# Altium schematic sheet Driver.SchDoc
size A3; SheetNumber: 3; SheetTotal: 3
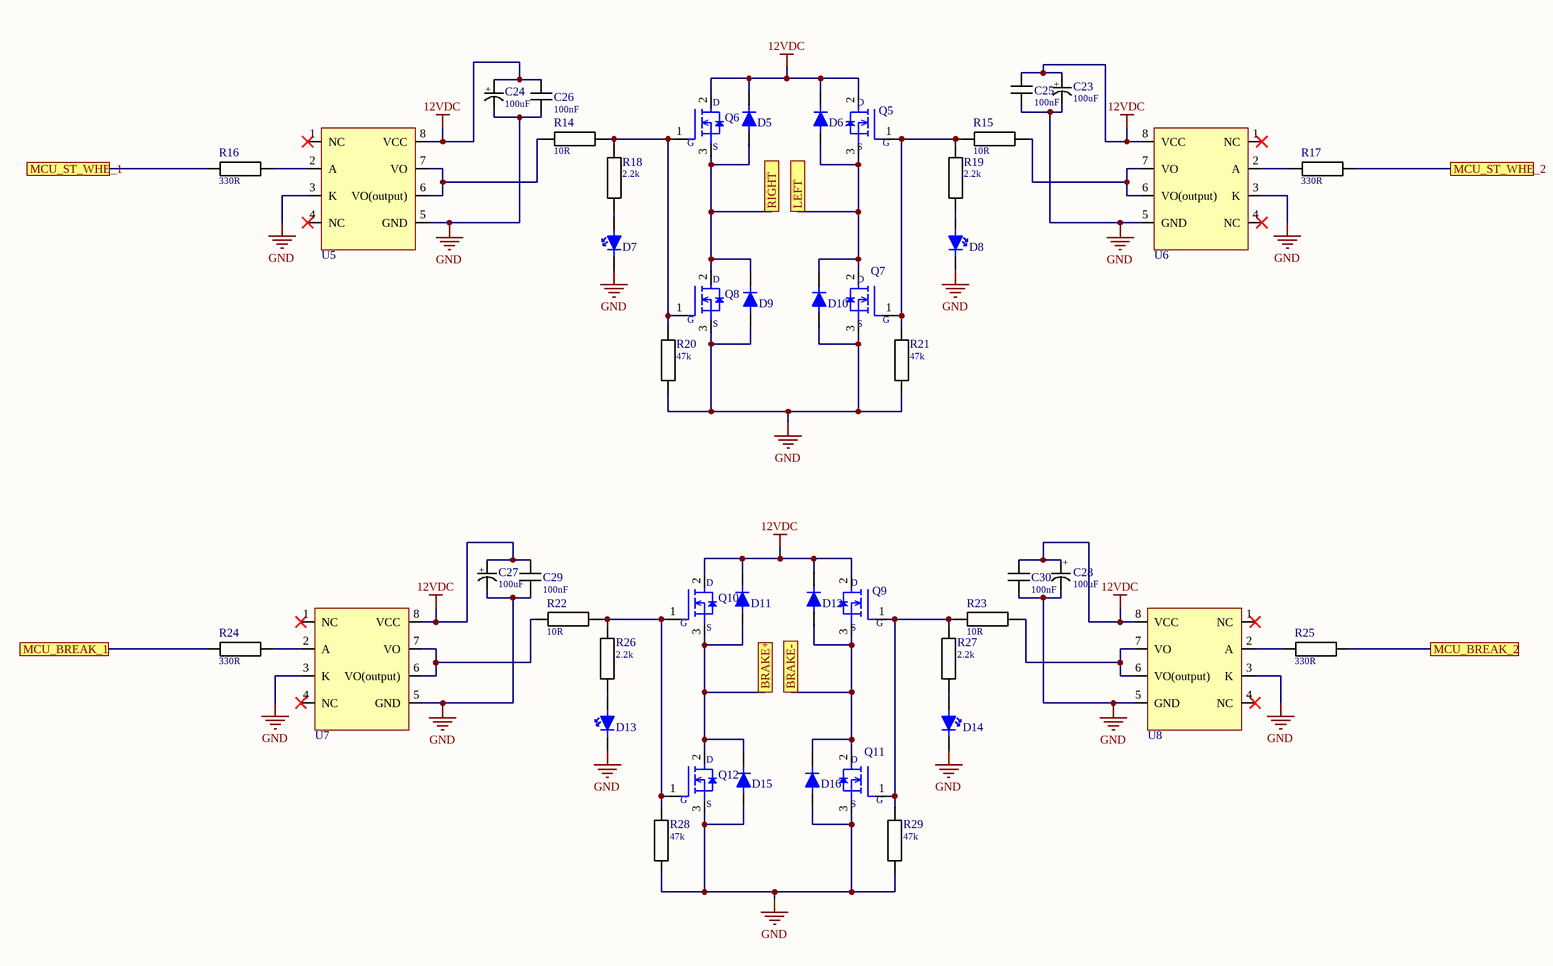
[diagram p0: Driver.SchDoc]

## Parts
C23  Capacitance: 100uF  [CAP_ELEC_EEE-HA0J101WR]  (hidden comment: EEE-HA0J101WR)
C24  Capacitance: 100uF  [CAP_ELEC_EEE-HA0J101WR]  (hidden comment: EEE-HA0J101WR)
C25  Capacitance: 100nF  [CAP_0805]  (hidden comment: C0805C104K5RAC7800)
C26  Capacitance: 100nF  [CAP_0805]  (hidden comment: C0805C104K5RAC7800)
C27  Capacitance: 100uF  [CAP_ELEC_EEE-HA0J101WR]  (hidden comment: EEE-HA0J101WR)
C28  Capacitance: 100uF  [CAP_ELEC_EEE-HA0J101WR]  (hidden comment: EEE-HA0J101WR)
C29  Capacitance: 100nF  [CAP_0805]  (hidden comment: C0805C104K5RAC7800)
C30  Capacitance: 100nF  [CAP_0805]  (hidden comment: C0805C104K5RAC7800)
D5  1N4001W  [SOD-123F]  (value not drawn)
D6  1N4001W  [SOD-123F]  (value not drawn)
D7  LTST-C171GKT  [LED_GREEN_0805]  (value not drawn)
D8  LTST-C171GKT  [LED_GREEN_0805]  (value not drawn)
D9  1N4001W  [SOD-123F]  (value not drawn)
D10  1N4001W  [SOD-123F]  (value not drawn)
D11  1N4001W  [SOD-123F]  (value not drawn)
D12  1N4001W  [SOD-123F]  (value not drawn)
D13  LTST-C171GKT  [LED_GREEN_0805]  (value not drawn)
D14  LTST-C171GKT  [LED_GREEN_0805]  (value not drawn)
D15  1N4001W  [SOD-123F]  (value not drawn)
D16  1N4001W  [SOD-123F]  (value not drawn)
Q5  IRF4905STRRPBF  [TO-263-3]  (value not drawn)
Q6  IRF4905STRRPBF  [TO-263-3]  (value not drawn)
Q7  IRF3710STRLPBF  [TO-263-3]  (value not drawn)
Q8  IRF3710STRLPBF  [TO-263-3]  (value not drawn)
Q9  IRF4905STRRPBF  [TO-263-3]  (value not drawn)
Q10  IRF4905STRRPBF  [TO-263-3]  (value not drawn)
Q11  IRF3710STRLPBF  [TO-263-3]  (value not drawn)
Q12  IRF3710STRLPBF  [TO-263-3]  (value not drawn)
R14  Resistance: 10R  [CAP_0805]  (hidden comment: RC0805FR-0710RL)
R15  Resistance: 10R  [CAP_0805]  (hidden comment: RC0805FR-0710RL)
R16  Resistance: 330R  [RES_0603]  (hidden comment: RC0603FR-07330RL)
R17  Resistance: 330R  [RES_0603]  (hidden comment: RC0603FR-07330RL)
R18  Resistance: 2.2k  [RES_0603]  (hidden comment: RC0603JR-072K2L)
R19  Resistance: 2.2k  [RES_0603]  (hidden comment: RC0603JR-072K2L)
R20  Resistance: 47k  [RES_0603]  (hidden comment: RC0603JR-0747KL)
R21  Resistance: 47k  [RES_0603]  (hidden comment: RC0603JR-0747KL)
R22  Resistance: 10R  [CAP_0805]  (hidden comment: RC0805FR-0710RL)
R23  Resistance: 10R  [CAP_0805]  (hidden comment: RC0805FR-0710RL)
R24  Resistance: 330R  [RES_0603]  (hidden comment: RC0603FR-07330RL)
R25  Resistance: 330R  [RES_0603]  (hidden comment: RC0603FR-07330RL)
R26  Resistance: 2.2k  [RES_0603]  (hidden comment: RC0603JR-072K2L)
R27  Resistance: 2.2k  [RES_0603]  (hidden comment: RC0603JR-072K2L)
R28  Resistance: 47k  [RES_0603]  (hidden comment: RC0603JR-0747KL)
R29  Resistance: 47k  [RES_0603]  (hidden comment: RC0603JR-0747KL)
U5  TLP250LF1F  [8-SMD]  (value not drawn)
U6  TLP250LF1F  [8-SMD]  (value not drawn)
U7  TLP250LF1F  [8-SMD]  (value not drawn)
U8  TLP250LF1F  [8-SMD]  (value not drawn)

## Ports
BRAKE+, BRAKE-, LEFT, MCU_BREAK_1, MCU_BREAK_2, MCU_ST_WHE_1, MCU_ST_WHE_2, RIGHT

## Nets
12VDC: C23.1 C24.1 C25.2 C26.2 C27.1 C28.1 C29.2 C30.2 D5.1 D6.1 D11.1 D12.1 Q5.2(G) Q6.2(G) Q9.2(G) Q10.2(G) U5.8(VCC) U6.8(VCC) U7.8(VCC) U8.8(VCC)
GND: C23.2 C24.2 C25.1 C26.1 C27.2 C28.2 C29.1 C30.1 D7.1 D8.1 D9.2 D10.2 D13.1 D14.1 D15.2 D16.2 Q7.3(D) Q8.3(D) Q11.3(D) Q12.3(D) R20.1 R21.1 R28.1 R29.1 U5.3(K) U5.5(GND) U6.3(K) U6.5(GND) U7.3(K) U7.5(GND) U8.3(K) U8.5(GND)
BRAKE+: D11.2 D15.1 Q10.3(D) Q12.2(G) ; port BRAKE+
BRAKE-: D12.2 D16.1 Q9.3(D) Q11.2(G) ; port BRAKE-
LEFT: D6.2 D10.1 Q5.3(D) Q7.2(G) ; port LEFT
MCU_BREAK_1: R24.1 ; port MCU_BREAK_1
MCU_BREAK_2: R25.1 ; port MCU_BREAK_2
MCU_ST_WHE_1: R16.1 ; port MCU_ST_WHE_1
MCU_ST_WHE_2: R17.1 ; port MCU_ST_WHE_2
RIGHT: D5.2 D9.1 Q6.3(D) Q8.2(G) ; port RIGHT
NetD7_2: D7.2 R18.1
NetD8_2: D8.2 R19.1
NetD13_2: D13.2 R26.1
NetD14_2: D14.2 R27.1
NetQ5_1: Q5.1(S) Q7.1(S) R15.2 R19.2 R21.2
NetQ6_1: Q6.1(S) Q8.1(S) R14.2 R18.2 R20.2
NetQ9_1: Q9.1(S) Q11.1(S) R23.2 R27.2 R29.2
NetQ10_1: Q10.1(S) Q12.1(S) R22.2 R26.2 R28.2
NetR14_1: R14.1 U5.6(VO(output)) U5.7(VO)
NetR15_1: R15.1 U6.6(VO(output)) U6.7(VO)
NetR16_2: R16.2 U5.2(A)
NetR17_2: R17.2 U6.2(A)
NetR22_1: R22.1 U7.6(VO(output)) U7.7(VO)
NetR23_1: R23.1 U8.6(VO(output)) U8.7(VO)
NetR24_2: R24.2 U7.2(A)
NetR25_2: R25.2 U8.2(A)

Not connected (* = marked no-connect by the designer): U5 1(NC)* 4(NC)*; U6 1(NC)* 4(NC)*; U7 1(NC)* 4(NC)*; U8 1(NC)* 4(NC)*

## Notes on the sheet
- DOSYA ADI / FILE NAME
- TANIM/DESCRIPTION
- KONTROL EDEN/CHECKED BY
- HAZIRLAYAN/PREPARED BY
- DEĞ. TARİHİ/CHANGE DATE
- YAYIN TARİHİ/REL. DATE
- ONAYLAYAN/APPROVED BY
- BÖLÜM/DEPARTMENT
- BOYUT/SİZE
- REVİZYON/REVISION
- SAYFA/SHEET
- (in symbol CAP 100uF Polar SMD) +

## Library data of the parts
C23 C24 C27 C28 = CAP 100uF Polar SMD: Cap Aluminum 100uF %20  SMD; Manufacturer: Panasonic; Tolerance: 20%; Ripple Current: 47mA; Voltage Rating: 6.3V; Polarity: Polar; Life (Hours): 1000Hour; Leakage Current: 6.3uA; Lead Diameter: 0.65mm; Designed by: Semih AŞÇI; Supplier 1: Digi-Key; Manufacturer Part Number: EEE-HA0J101WR; RoHS: Yes; Category: Aluminum Electrolytic Capacitors; Stock 1: 374; Pricing 1: 1=0,40000, 10=0,27900, 50=0,19560, 100=0,16770, 500=0,12576 (USD); Mount: Surface Mount,PCB; Case/Package: Radial; Contact Plating: Tin; Min Operating Temperature: -40°C; Max Operating Temperature: 105°C; Packaging: Tape and Reel; Ripple Current (AC): 47mA; Package Quantity: 1000; Voltage Rating (DC): 6.3V; Termination: SMD/SMT; Voltage: 6.3V; Series: HA; Construction: Cylindrical; Diameter: 5mm; Length: 5.5mm; Width: 650um; Height: 5.4mm; Lead Pitch: 1.5mm; Height - Seated (Max): 0.213inch; Radiation Hardening: No; REACH SVHC: Unknown; Lead Free: Lead Free; RoHS Compliant: Yes; ComponentLink1URL: https://datasheet.ciiva.com/28694/1446029-28694662.pdf?src-supplier=Element14; ComponentLink1Description: https://datasheet.ciiva.com/28694/1446029-28694662.pdf?src-supplier=Element14; ComponentLink2URL: https://datasheet.ciiva.com/17536/aba0000ce3-17536407.pdf?src-supplier=Avnet+Europe; ComponentLink2Description: https://datasheet.ciiva.com/17536/aba0000ce3-17536407.pdf?src-supplier=Avnet+Europe; ComponentLink3URL: https://datasheet.ciiva.com/46390/1446029-46390441.pdf?src-supplier=Element14; ComponentLink3Description: https://datasheet.ciiva.com/46390/1446029-46390441.pdf?src-supplier=Element14; ComponentLink4URL: https://datasheet.ciiva.com/30215/33aba0000ce3-30215722.pdf?src-supplier=Onlinecomponents.com; ComponentLink4Description: https://datasheet.ciiva.com/30215/33aba0000ce3-30215722.pdf?src-supplier=Onlinecomponents.com; ComponentLink5URL: https://datasheet.ciiva.com/24068/aba0000ce3-259063-24068875.pdf?src-supplier=Mouser; ComponentLink5Description: https://datasheet.ciiva.com/24068/aba0000ce3-259063-24068875.pdf?src-supplier=Mouser; ComponentLink6URL: https://datasheet.ciiva.com/11675/aba0000ce3-11675884.pdf?src-supplier=Avnet; ComponentLink6Description: https://datasheet.ciiva.com/11675/aba0000ce3-11675884.pdf?src-supplier=Avnet; ComponentLink7URL: https://datasheet.ciiva.com/14604/70256712-14604190.pdf?src-supplier=Allied+Electronics; ComponentLink7Description: https://datasheet.ciiva.com/14604/70256712-14604190.pdf?src-supplier=Allied+Electronics; ComponentLink8URL: https://datasheet.ciiva.com/43459/1446029-43459799.pdf?src-supplier=Farnell; ComponentLink8Description: https://datasheet.ciiva.com/43459/1446029-43459799.pdf?src-supplier=Farnell; ComponentLink9URL: https://datasheet.ciiva.com/2985/aba0000ce3-2985609.pdf?src-supplier=Avnet; ComponentLink9Description: https://datasheet.ciiva.com/2985/aba0000ce3-2985609.pdf?src-supplier=Avnet; ComponentLink10URL: https://datasheet.ciiva.com/6134/1446029-6134153.pdf?src-supplier=Farnell; ComponentLink10Description: https://datasheet.ciiva.com/6134/1446029-6134153.pdf?src-supplier=Farnell; ComponentLink11URL: https://datasheet.ciiva.com/14599/70256712-14599913.pdf?src-supplier=Allied+Electronics; ComponentLink11Description: https://datasheet.ciiva.com/14599/70256712-14599913.pdf?src-supplier=Allied+Electronics; ComponentLink12URL: https://datasheet.ciiva.com/16433/aba0000ce3-16433449.pdf?src-supplier=Future+Electronics; ComponentLink12Description: https://datasheet.ciiva.com/16433/aba0000ce3-16433449.pdf?src-supplier=Future+Electronics; Supplier Part Number 1: PCE4156CT-ND
C25 C26 C29 C30 = CAP 100nF 0805: Cap Ceramic 100nF %10 SMD 0805; Manufacturer: KEMET; Manufacturer Part Number: C0805C104K5RACTU; Tolerance: 10%; Dielectric: X7R; Voltage Rating: 50V; Voltage: 500V; Designed by: Semih AŞÇI; Supplier 1: Digi-Key; RoHS: Yes; Category: Ceramic Capacitors; Stock 1: 36; Pricing 1: 1=0,15000, 10=0,10500, 50=0,05960, 100=0,04940, 500=0,03466, 1000=0,02869 (USD); Mount: Surface Mount,PCB; Case/Package: 0805; Number of Pins: 2; Case Code (Imperial): 0805; Case Code (Metric): 2012; Contact Plating: Tin,Matte; Dielectric Material: Ceramic; Min Operating Temperature: -55°C; Max Operating Temperature: 125°C; Package Quantity: 4000; Packaging: Tape and Reel; Voltage Rating (DC): 50V; Termination: SMD/SMT; Series: C0805C; Construction: Flat; Length: 2mm; Width: 1.2mm; Height: 0.9mm; Depth: 1.25mm; Lead Pitch: 0.75mm; Thickness: 0.035inch; Radiation Hardening: No; REACH SVHC: No SVHC; RoHS Compliant: Yes; ComponentLink1URL: https://datasheet.ciiva.com/32431/slceramic-chip-condensers-e-32431755.pdf?src-supplier=Distrelec; ComponentLink1Description: https://datasheet.ciiva.com/32431/slceramic-chip-condensers-e-32431755.pdf?src-supplier=Distrelec; ComponentLink2URL: https://datasheet.ciiva.com/28682/1851736-28682232.pdf?src-supplier=Element14; ComponentLink2Description: https://datasheet.ciiva.com/28682/1851736-28682232.pdf?src-supplier=Element14; ComponentLink3URL: https://datasheet.ciiva.com/18410/70095383-18410815.pdf?src-supplier=Allied+Electronics; ComponentLink3Description: https://datasheet.ciiva.com/18410/70095383-18410815.pdf?src-supplier=Allied+Electronics; ComponentLink4URL: https://datasheet.ciiva.com/14589/70095383-14589048.pdf?src-supplier=Allied+Electronics; ComponentLink4Description: https://datasheet.ciiva.com/14589/70095383-14589048.pdf?src-supplier=Allied+Electronics; Supplier Part Number 1: 399-C0805C104K5RAC7800CT-ND
D5 D6 D9-D12 D15 D16 = 1N4001W: Diode Standard Recovery Rectifier 50 Volt 1A 2-Pin SMB Tape and Reel; Manufacturer: Diodes; Manufacturer Part Number: S1AB-13; Designed by: Semih AŞÇI; Max Surge Current: 30A; Forward Voltage: 1.1V; Recovery Time: 3000ns; Reverse Voltage (DC): 50V; Reverse Recovery Time: 3us; Max Reverse Current: 5uA; Element Configuration: Single; Capacitance: 10pF; Supplier 1: Digi-Key; RoHS: No; Category: Rectifier Diodes; Mount: Surface Mount; Case/Package: SMB; Number of Pins: 2; Weight: 0.00328oz; Min Operating Temperature: -65°C; Max Operating Temperature: 150°C; Packaging: Tape and Reel; Forward Current: 1A; Package Quantity: 3000; Average Rectified Current: 1A; Max Repetitive Reverse Voltage (Vrrm): 50V; Peak Non-Repetitive Surge Current: 30A; Termination: SMD/SMT; Polarity: Standard; Voltage Rating (DC): 50V; Current Rating: 1A; Output Current: 1A; Max Reverse Voltage (DC): 50V; Series: -; Length: 4.57mm; Width: 3.94mm; Height: 2.42mm; Radiation Hardening: No; Lead Free: Contains Lead; RoHS Compliant: No; ComponentLink1URL: https://datasheet.ciiva.com/911/ds16003-911872.pdf?src-supplier=Avnet; ComponentLink1Description: https://datasheet.ciiva.com/911/ds16003-911872.pdf?src-supplier=Avnet; ComponentLink2URL: https://datasheet.ciiva.com/27052/1591341-27052665.pdf?src-supplier=Jameco; ComponentLink2Description: https://datasheet.ciiva.com/27052/1591341-27052665.pdf?src-supplier=Jameco; ComponentLink3URL: https://datasheet.ciiva.com/925/ds16003-925417.pdf?src-supplier=Digi-Key; ComponentLink3Description: https://datasheet.ciiva.com/925/ds16003-925417.pdf?src-supplier=Digi-Key; ComponentLink4URL: https://datasheet.ciiva.com/925/ds16003-925415.pdf?src-supplier=Digi-Key; ComponentLink4Description: https://datasheet.ciiva.com/925/ds16003-925415.pdf?src-supplier=Digi-Key; ComponentLink5URL: https://datasheet.ciiva.com/925/ds16003-925416.pdf?src-supplier=Digi-Key; ComponentLink5Description: https://datasheet.ciiva.com/925/ds16003-925416.pdf?src-supplier=Digi-Key; Supplier Part Number 1: S1ABDICT-ND
D7 D8 D13 D14 = LED GREEN: Green 0805 130 º Min 5 mcd Typical 12 mcd Water Clear Lens SMT LED; Manufacturer: Vishay Lite-On; Designed by: Semih AŞÇI; Lens Color: Colorless; Viewing Angle: 130°; Lens Style: Diffused,Colorless,Rectangular,Clear; Luminous Intensity: 12mcd; Forward Current: 30mA; Forward Voltage: 2.1V; Power Rating: 100mW; Dominant Wavelength: 569nm; Test Current: 10mA; Number of Elements: 1; Wavelength: 585nm; Reverse Voltage: 5V; Supplier 1: RSComponents; Manufacturer Part Number: LTST-C171GKT; RoHS: Yes; Category: LEDs; Stock 1: 9700; Pricing 1: 50=0,16300, 250=0,07300, 500=0,07100, 1250=0,06000, 2500=0,05700, 50=0,11800, 250=0,05300, 500=0,05100, 1250=0,04300, 2500=0,04100 (USD); Mount: Surface Mount; Case/Package: 0805; Number of Pins: 2; Color: Green; Case Code (Metric): 2012; Case Code (Imperial): 0805; Min Operating Temperature: -55°C; Max Operating Temperature: 85°C; Package Quantity: 1; Packaging: Tape and Reel; Illumination Color: Green; Lens Transparency: Clear; Power Dissipation: 100mW; Number of LEDs: 1; Series: CHIPLED 0805; Length: 2mm; Width: 1.25mm; Height: 0.8mm; Depth: 1.25mm; Radiation Hardening: No; Lead Free: Lead Free; RoHS Compliant: Yes; ComponentLink1URL: https://datasheet.ciiva.com/2110/ltst-c171gkt-2110000.pdf?src-supplier=Digi-Key; ComponentLink1Description: https://datasheet.ciiva.com/2110/ltst-c171gkt-2110000.pdf?src-supplier=Digi-Key; ComponentLink2URL: https://datasheet.ciiva.com/11773/0900766b80dc0296-11773991.pdf?src-supplier=RSComponents; ComponentLink2Description: https://datasheet.ciiva.com/11773/0900766b80dc0296-11773991.pdf?src-supplier=RSComponents; ComponentLink3URL: https://datasheet.ciiva.com/12400/lite-on-ltst-c171gkt-190133-12400647.pdf?src-supplier=Mouser; ComponentLink3Description: https://datasheet.ciiva.com/12400/lite-on-ltst-c171gkt-190133-12400647.pdf?src-supplier=Mouser; ComponentLink4URL: https://datasheet.ciiva.com/2110/ltst-c171gkt-2110001.pdf?src-supplier=Digi-Key; ComponentLink4Description: https://datasheet.ciiva.com/2110/ltst-c171gkt-2110001.pdf?src-supplier=Digi-Key; ComponentLink5URL: https://datasheet.ciiva.com/2110/ltst-c171gkt-2110002.pdf?src-supplier=Digi-Key; ComponentLink5Description: https://datasheet.ciiva.com/2110/ltst-c171gkt-2110002.pdf?src-supplier=Digi-Key; ComponentLink6URL: https://datasheet.ciiva.com/16396/ltst-c171gkt-16396549.pdf?src-supplier=Future+Electronics; ComponentLink6Description: https://datasheet.ciiva.com/16396/ltst-c171gkt-16396549.pdf?src-supplier=Future+Electronics; Supplier Part Number 1: 6920935
Q5 Q6 Q9 Q10 = IRF4905STRRPBF: Transistor PNP Mos IRF4905S INTERNATIONAL RECTIFIER RoHS Ampere=64 V=55 D2PAK; Manufacturer: Infineon; Manufacturer Part Number: IRF4905STRLPBF; Designed by: Semih AŞÇI; Continuous Drain Current (ID): 42A; Drain to Source Voltage (Vdss): -55V; Rds On Max: 20mR; Input Capacitance: 3.5nF; Max Power Dissipation: 170W; Threshold Voltage: 4V; Supplier 1: Digi-Key; RoHS: Yes; Category: MOSFETs; Pricing 1: 1=2,57000, 10=2,30900, 100=1,85570 (USD); Mount: Surface Mount; Case/Package: TO-263-3; Number of Pins: 3; Min Operating Temperature: -55°C; Max Operating Temperature: 150°C; Packaging: Tape and Reel; Max Dual Supply Voltage: -55V; Lead Free: Contains Lead; RoHS Compliant: Yes; REACH SVHC: No SVHC; Halogen Free: Halogen Free; ComponentLink1URL: http://www.farnell.com/datasheets/136279.pdf?src-supplier=Farnell; ComponentLink1Description: http://www.farnell.com/datasheets/136279.pdf?src-supplier=Farnell; ComponentLink2URL: http://www.farnell.com/datasheets/136264.pdf?src-supplier=Element14; ComponentLink2Description: http://www.farnell.com/datasheets/136264.pdf?src-supplier=Element14; ComponentLink3URL: http://www.farnell.com/datasheets/136279.pdf?src-supplier=Newark; ComponentLink3Description: http://www.farnell.com/datasheets/136279.pdf?src-supplier=Newark; ComponentLink4URL: https://www.infineon.com/dgdl/irf4905spbf.pdf?fileId=5546d462533600a4015355e331c41980&src-supplier=Digi-Key; ComponentLink4Description: https://www.infineon.com/dgdl/irf4905spbf.pdf?fileId=5546d462533600a4015355e331c41980&src-supplier=Digi-Key; ComponentLink5URL: http://www.infineon.com/dgdl/irf4905spbf.pdf?fileId=5546d462533600a4015355e331c41980&src-supplier=Digi-Key; ComponentLink5Description: http://www.infineon.com/dgdl/irf4905spbf.pdf?fileId=5546d462533600a4015355e331c41980&src-supplier=Digi-Key; Supplier Part Number 1: IRF4905STRLPBFCT-ND
Q7 Q8 Q11 Q12 = IRF3710STRLPBF: Single N-Channel 100 V 23 mOhm 130nC HEXFET® Power Mosfet - D2PAK; Manufacturer: International Rectifier; Designed by: Semih AŞÇI; Continuous Drain Current (ID): 57A; Gate to Source Voltage (Vgs): 20V; Rise Time: 58ns; Drain to Source Breakdown Voltage: 100V; Power Dissipation: 200W; Drain to Source Resistance: 23mR; Turn-On Delay Time: 12ns; Turn-Off Delay Time: 45ns; Input Capacitance: 3.13nF; Number of Elements: 1; Fall Time: 47ns; Nominal Vgs: 4V; Supplier 1: Digi-Key; Manufacturer Part Number: IRF3710STRLPBF; RoHS: Yes; Category: MOSFETs; Mount: Surface Mount; Case/Package: D2PAK; Number of Pins: 3; Min Operating Temperature: -55°C; Max Operating Temperature: 175°C; Rds On Max: 23mR; Packaging: Tape and Reel; Max Power Dissipation: 200W; Drain to Source Voltage (Vdss): 100V; Voltage Rating (DC): 100V; Current Rating: 57A; Package Quantity: 800; On-State Resistance: 23MR; Dual Supply Voltage: 100V; Termination: SMD/SMT; Series: HEXFET®; Drain-source On Resistance-Max: 23MR; Length: 10.67mm; Width: 9.65mm; Height: 4.83mm; Radiation Hardening: No; Lead Free: Lead Free; REACH SVHC: No SVHC; RoHS Compliant: Yes; ComponentLink1URL: https://datasheet.ciiva.com/34302/1559818-34302485.pdf?src-supplier=Jameco; ComponentLink1Description: https://datasheet.ciiva.com/34302/1559818-34302485.pdf?src-supplier=Jameco; ComponentLink2URL: https://datasheet.ciiva.com/938/irf3710spbf-938820.pdf?src-supplier=Digi-Key; ComponentLink2Description: https://datasheet.ciiva.com/938/irf3710spbf-938820.pdf?src-supplier=Digi-Key; ComponentLink3URL: https://datasheet.ciiva.com/938/irf3710spbf-938821.pdf?src-supplier=Digi-Key; ComponentLink3Description: https://datasheet.ciiva.com/938/irf3710spbf-938821.pdf?src-supplier=Digi-Key; ComponentLink4URL: https://datasheet.ciiva.com/938/irf3710spbf-938819.pdf?src-supplier=Digi-Key; ComponentLink4Description: https://datasheet.ciiva.com/938/irf3710spbf-938819.pdf?src-supplier=Digi-Key; ComponentLink5URL: https://datasheet.ciiva.com/16286/irf3710spbf-16286326.pdf?src-supplier=Future+Electronics; ComponentLink5Description: https://datasheet.ciiva.com/16286/irf3710spbf-16286326.pdf?src-supplier=Future+Electronics; ComponentLink6URL: https://datasheet.ciiva.com/7835/irf3710spbf-7835833.pdf?src-supplier=Element14; ComponentLink6Description: https://datasheet.ciiva.com/7835/irf3710spbf-7835833.pdf?src-supplier=Element14; Supplier Part Number 1: IRF3710STRLPBFDKR-ND
R14 R15 R22 R23 = RES 10 OHM 0805: Res 10 Ohm %1 SMD 0805; Manufacturer: Yageo; Designed by: Semih AŞÇI; Power Rating: 125mW; Tolerance: 1%; Voltage Rating: 150V; Temperature Coefficient: 200ppm/°C; Supplier 1: Digi-Key; Manufacturer Part Number: RC0805FR-0710RL; RoHS: Yes; Category: Chip SMD Resistors; Stock 1: 1909118; Pricing 1: 5000=0,01090 (USD); Case/Package: 0805; Number of Pins: 2; Case Code (Imperial): 0805; Case Code (Metric): 2012; Size Code: 0805; Min Operating Temperature: -55°C; Max Operating Temperature: 155°C; Packaging: Tape and Reel; Voltage Rating (DC): 150V; Package Quantity: 1; Termination: SMD/SMT; Resistor Type: Thick Film; Number of Terminations: 2; Max Power Dissipation: 125mW; Features: Moisture Resistant; Series: RC; Resistance Tolerance: 1%; Construction: Rectangular; Technology: THICK FILM; Length: 2mm; Width: 1.25mm; Height: 0.5mm; Depth: 1.25mm; RoHS Compliant: Yes; REACH SVHC: No SVHC; Lead Free: Lead Free; ComponentLink1URL: https://datasheet.ciiva.com/11809/0900766b8106beab-11809370.pdf?src-supplier=RSComponents; ComponentLink1Description: https://datasheet.ciiva.com/11809/0900766b8106beab-11809370.pdf?src-supplier=RSComponents; ComponentLink2URL: https://datasheet.ciiva.com/7941/444164-7941687.pdf?src-supplier=Element14; ComponentLink2Description: https://datasheet.ciiva.com/7941/444164-7941687.pdf?src-supplier=Element14; ComponentLink3URL: https://datasheet.ciiva.com/7941/444164-7941688.pdf?src-supplier=Element14; ComponentLink3Description: https://datasheet.ciiva.com/7941/444164-7941688.pdf?src-supplier=Element14; ComponentLink4URL: https://datasheet.ciiva.com/46412/444164-46412859.pdf?src-supplier=Element14; ComponentLink4Description: https://datasheet.ciiva.com/46412/444164-46412859.pdf?src-supplier=Element14; ComponentLink5URL: https://datasheet.ciiva.com/2457/pyu-r-int-thick-7-2457100.pdf?src-supplier=Digi-Key; ComponentLink5Description: https://datasheet.ciiva.com/2457/pyu-r-int-thick-7-2457100.pdf?src-supplier=Digi-Key; ComponentLink6URL: https://datasheet.ciiva.com/46447/444164-46447565.pdf?src-supplier=Element14; ComponentLink6Description: https://datasheet.ciiva.com/46447/444164-46447565.pdf?src-supplier=Element14; ComponentLink7URL: https://datasheet.ciiva.com/12555/rc0805-257173-12555112.pdf?src-supplier=Mouser; ComponentLink7Description: https://datasheet.ciiva.com/12555/rc0805-257173-12555112.pdf?src-supplier=Mouser; ComponentLink8URL: https://datasheet.ciiva.com/2457/pyu-r-int-thick-7-2457098.pdf?src-supplier=Digi-Key; ComponentLink8Description: https://datasheet.ciiva.com/2457/pyu-r-int-thick-7-2457098.pdf?src-supplier=Digi-Key; ComponentLink9URL: https://datasheet.ciiva.com/2457/pyu-r-int-thick-7-2457099.pdf?src-supplier=Digi-Key; ComponentLink9Description: https://datasheet.ciiva.com/2457/pyu-r-int-thick-7-2457099.pdf?src-supplier=Digi-Key; Supplier Part Number 1: 311-10.0CRTR-ND
R16 R17 R24 R25 = RES 330 OHM 0603: Res 330 Ohm %1 SMD 0603; Manufacturer: Yageo; Designed by: Semih AŞÇI; Tolerance: 1%; Temperature Coefficient: 100ppm/°C; Voltage Rating (DC): 50V; Power Rating: 100mW; Supplier 1: Digi-Key; Manufacturer Part Number: RC0603FR-07330RL; RoHS: Yes; Category: Chip SMD Resistors; Stock 1: 2320717; Pricing 1: 1=0,10000, 10=0,02400, 100=0,00970, 1000=0,00436, 2500=0,00378 (USD); Case/Package: 0603; Number of Pins: 2; Case Code (Metric): 1608; Case Code (Imperial): 0603; Size Code: 0603; Min Operating Temperature: -55°C; Max Operating Temperature: 155°C; Resistor Type: Thick Film; Packaging: Tape and Reel; Voltage Rating: 50V; Package Quantity: 1; Number of Terminations: 2; Termination: SMD/SMT; Max Power Dissipation: 100mW; Features: Moisture Resistant; Series: RC; Resistance Tolerance: 1%; Technology: THICK FILM; Length: 1.6mm; Width: 0.8mm; Height: 0.45mm; Depth: 0.8mm; REACH SVHC: No SVHC; Lead Free: Lead Free; RoHS Compliant: Yes; ComponentLink1URL: https://datasheet.ciiva.com/11819/0900766b80f96399-11819327.pdf?src-supplier=RSComponents; ComponentLink1Description: https://datasheet.ciiva.com/11819/0900766b80f96399-11819327.pdf?src-supplier=RSComponents; ComponentLink2URL: https://datasheet.ciiva.com/2454/pyu-r-int-thick-7-2454864.pdf?src-supplier=Digi-Key; ComponentLink2Description: https://datasheet.ciiva.com/2454/pyu-r-int-thick-7-2454864.pdf?src-supplier=Digi-Key; ComponentLink3URL: https://datasheet.ciiva.com/2454/pyu-r-int-thick-7-2454865.pdf?src-supplier=Digi-Key; ComponentLink3Description: https://datasheet.ciiva.com/2454/pyu-r-int-thick-7-2454865.pdf?src-supplier=Digi-Key; ComponentLink4URL: https://datasheet.ciiva.com/2454/pyu-r-int-thick-7-2454866.pdf?src-supplier=Digi-Key; ComponentLink4Description: https://datasheet.ciiva.com/2454/pyu-r-int-thick-7-2454866.pdf?src-supplier=Digi-Key; ComponentLink5URL: https://datasheet.ciiva.com/12555/rc0603-272842-12555334.pdf?src-supplier=Mouser; ComponentLink5Description: https://datasheet.ciiva.com/12555/rc0603-272842-12555334.pdf?src-supplier=Mouser; ComponentLink6URL: https://datasheet.ciiva.com/46440/1868787-46440904.pdf?src-supplier=Element14; ComponentLink6Description: https://datasheet.ciiva.com/46440/1868787-46440904.pdf?src-supplier=Element14; ComponentLink7URL: https://datasheet.ciiva.com/7746/443971-7746329.pdf?src-supplier=Element14; ComponentLink7Description: https://datasheet.ciiva.com/7746/443971-7746329.pdf?src-supplier=Element14; ComponentLink8URL: https://datasheet.ciiva.com/7746/443971-7746330.pdf?src-supplier=Element14; ComponentLink8Description: https://datasheet.ciiva.com/7746/443971-7746330.pdf?src-supplier=Element14; ComponentLink9URL: https://datasheet.ciiva.com/7746/1686128-7746331.pdf?src-supplier=Element14; ComponentLink9Description: https://datasheet.ciiva.com/7746/1686128-7746331.pdf?src-supplier=Element14; Supplier Part Number 1: 311-330HRCT-ND
R18 R19 R26 R27 = RES 2.2k OHM 0603: Res 2.2k Ohm %5 SMD 0603; Manufacturer: Yageo; Designed by: Semih AŞÇI; Tolerance: 5%; Temperature Coefficient: 100ppm/°C; Voltage Rating (DC): 50V; Power Rating: 100mW; Supplier 1: Digi-Key; Manufacturer Part Number: RC0603JR-072K2L; RoHS: Yes; Category: Chip SMD Resistors; Stock 1: 2616414; Pricing 1: 1=0,10000, 10=0,02000, 100=0,00800, 1000=0,00360, 2500=0,00312 (USD); Case/Package: 0603; Number of Pins: 2; Case Code (Imperial): 0603; Case Code (Metric): 1608; Size Code: 0603; Min Operating Temperature: -55°C; Max Operating Temperature: 155°C; Resistor Type: Thick Film; Packaging: Tape and Reel; Voltage Rating: 50V; Termination: SMD/SMT; Features: Moisture Resistant; Series: RC; Max Power Dissipation: 100mW; Number of Terminations: 2; Resistance Tolerance: 5%; Construction: Rectangular; Length: 1.6mm; Width: 0.8mm; Depth: 0.8mm; REACH SVHC: Unknown; Lead Free: Lead Free; Military Standard: Not; RoHS Compliant: Yes; ComponentLink1URL: http://www.mouser.com/ds/2/447/RC0603-272842.pdf?src-supplier=Mouser; ComponentLink1Description: http://www.mouser.com/ds/2/447/RC0603-272842.pdf?src-supplier=Mouser; ComponentLink2URL: http://www.farnell.com/datasheets/1868787.pdf?src-supplier=Farnell; ComponentLink2Description: http://www.farnell.com/datasheets/1868787.pdf?src-supplier=Farnell; ComponentLink3URL: http://components.arrow.com/part/dataview/0323_00047615?src-supplier=Arrow+Europe; ComponentLink3Description: http://components.arrow.com/part/dataview/0323_00047615?src-supplier=Arrow+Europe; ComponentLink4URL: http://www.farnell.com/datasheets/1868787.pdf?src-supplier=Element14; ComponentLink4Description: http://www.farnell.com/datasheets/1868787.pdf?src-supplier=Element14; ComponentLink5URL: http://www.yageo.com/documents/recent/PYu-RC_Group_51_RoHS_L_10.pdf?src-supplier=Digi-Key; ComponentLink5Description: http://www.yageo.com/documents/recent/PYu-RC_Group_51_RoHS_L_10.pdf?src-supplier=Digi-Key; ComponentLink6URL: http://www.farnell.com/datasheets/2167052.pdf?src-supplier=Newark; ComponentLink6Description: http://www.farnell.com/datasheets/2167052.pdf?src-supplier=Newark; ComponentLink7URL: http://www.yageo.com/documents/recent/PYu-RC0603_51_RoHS_L_7.pdf?src-supplier=Future+Electronics; ComponentLink7Description: http://www.yageo.com/documents/recent/PYu-RC0603_51_RoHS_L_7.pdf?src-supplier=Future+Electronics; Supplier Part Number 1: 311-2.2KGRCT-ND
R20 R21 R28 R29 = RES 47k OHM 0603: Res 47k Ohm %5 SMD 0603; Manufacturer: Yageo; Designed by: Semih AŞÇI; Tolerance: 5%; Power Rating: 100mW; Voltage Rating (DC): 50V; Temperature Coefficient: 100ppm/°C; Supplier 1: Digi-Key; Manufacturer Part Number: RC0603JR-0747KL; RoHS: Yes; Category: Chip SMD Resistors; Stock 1: 2577247; Pricing 1: 1=0,10000, 10=0,02000, 100=0,00800, 1000=0,00360, 2500=0,00312 (USD); Case/Package: 0603; Number of Pins: 2; Case Code (Imperial): 0603; Case Code (Metric): 1608; Size Code: 0603; Min Operating Temperature: -55°C; Max Operating Temperature: 155°C; Packaging: Tape and Reel; Resistor Type: Thick Film; Voltage Rating: 50V; Package Quantity: 5000; Termination: SMD/SMT; Features: Moisture Resistant; Series: RC; Max Power Dissipation: 100mW; Number of Terminations: 2; Construction: Rectangular; Resistance Tolerance: 5%; Length: 1.6mm; Width: 0.8mm; Height: 0.45mm; Depth: 0.8mm; REACH SVHC: No SVHC; Lead Free: Lead Free; RoHS Compliant: Yes; Military Standard: Not; Supplier Part Number 1: 311-47KGRCT-ND
U5-U8 = TLP250: Photocoupler Hs Trans Out 8-SMD; Manufacturer: Toshiba; Manufacturer Part Number: TLP250(LF1,F); Designed by: Semih AŞÇI; Propagation Delay: 500ns; Output Current per Channel: 1.5A; Number of Channels: 1; High Level Output Current: 500mA; Forward Voltage: 1.6V; Input Type: DC; Approvals: UR; Supplier 1: RSComponents; RoHS: Yes; Category: Optocouplers; Stock 1: 1; Pricing 1: 1=3,56000, 25=3,14400, 100=2,38300, 250=2,34100 (USD); Mount: Surface Mount; Case/Package: SMD/SMT; Number of Pins: 8; Min Operating Temperature: -20°C; Max Operating Temperature: 85°C; Package Quantity: 1; Packaging: Rail/Tube; Low Level Output Current: 500mA; Max Output Current: 1.5A; Series: -; Lead Free: Lead Free; ComponentLink1URL: https://datasheet.ciiva.com/2083/tlp250-2083442.pdf?src-supplier=Digi-Key; ComponentLink1Description: https://datasheet.ciiva.com/2083/tlp250-2083442.pdf?src-supplier=Digi-Key; ComponentLink2URL: https://datasheet.ciiva.com/26911/tlp250-lf1-f-26911994.pdf?src-supplier=IIIC; ComponentLink2Description: https://datasheet.ciiva.com/26911/tlp250-lf1-f-26911994.pdf?src-supplier=IIIC; ComponentLink3URL: https://datasheet.ciiva.com/2085/tlp250-2085867.pdf?src-supplier=Digi-Key; ComponentLink3Description: https://datasheet.ciiva.com/2085/tlp250-2085867.pdf?src-supplier=Digi-Key; ComponentLink4URL: https://datasheet.ciiva.com/2085/tlp250-2085868.pdf?src-supplier=Digi-Key; ComponentLink4Description: https://datasheet.ciiva.com/2085/tlp250-2085868.pdf?src-supplier=Digi-Key; Supplier Part Number 1: 0582133